# Altium schematic sheet Sheet1.SchDoc
size A; SheetNumber: 1; SheetTotal: 1
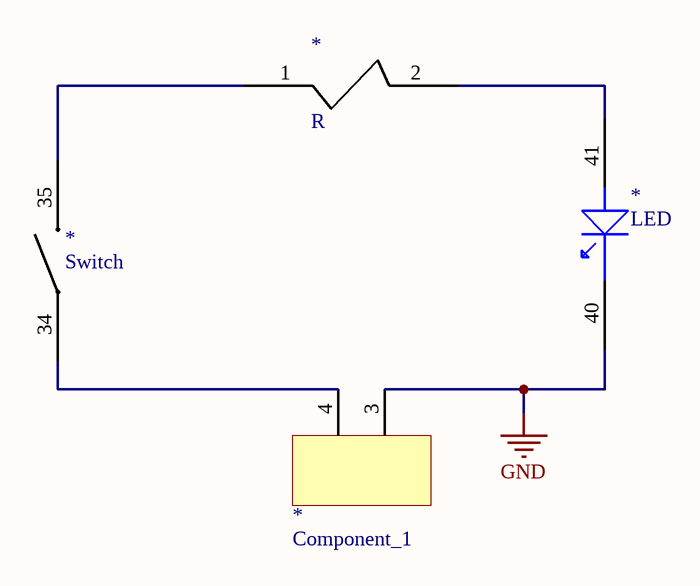
[diagram p0: Sheet1.SchDoc]

## Parts
(Parts that share a designator on the sheet are numbered #1, #2 ... from top to bottom, then left to right.)
*#1  R  [Resistor0603]
*#2  Switch  [Swicth]
*#3  LED  [LED]
*#4  Component_1  [Connector]

## Nets
GND: *#3.40 *#4.3
Net*#1_1: *#1.1 *#2.35
Net*#1_2: *#1.2 *#3.41
Net*#2_34: *#2.34 *#4.4